# EAGLE design 2313proto (EAGLE 5.01)
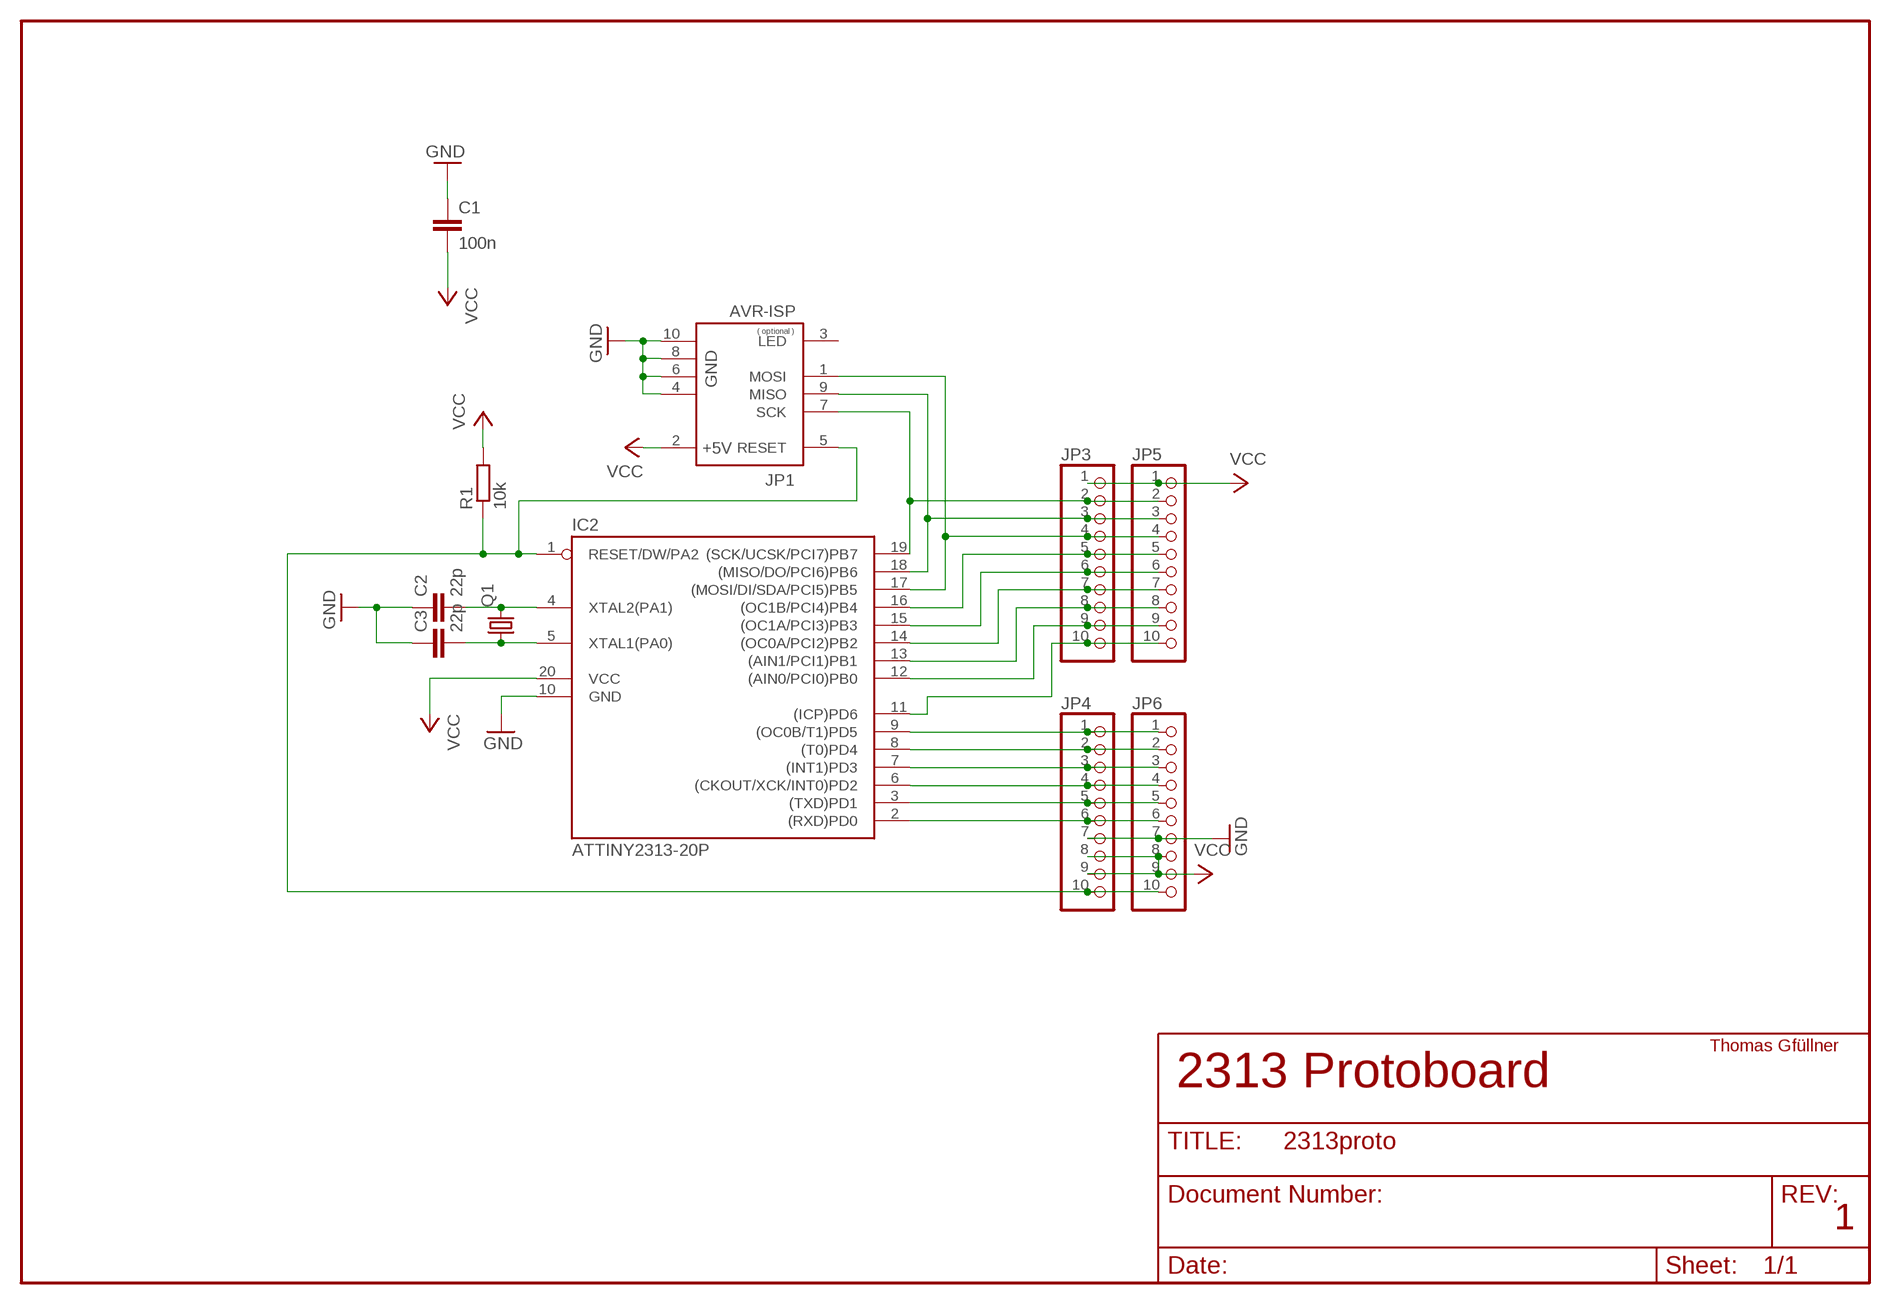
[diagram p0: schematic, sheet 1]

## Parts
C1  100n  C-EUC0805  [C0805]
C2  22p  C-EU025-024X044  [C025-024X044]
C3  22p  C-EU025-024X044  [C025-024X044]
IC2  ATTINY2313-20P  [DIL20]
JP1  AVR-ISP  [ML10]
JP3  PINHD-1X10  [1X10]
JP4  PINHD-1X10  [1X10]
JP5  PINHD-1X10  [1X10]
JP6  PINHD-1X10  [1X10]
Q1  CRYSTALHC49S  [HC49/S]
R1  10k  R-EU_R0805  [R0805]

## Nets
GND: C1.1 C2.1 C3.1 IC2.10(GND) JP1.4(GND) JP1.6(GND) JP1.8(GND) JP1.10(GND) JP4.7 JP6.7
N$1: C2.2 IC2.4(XTAL2(PA1)) Q1.2
N$2: C3.2 IC2.5(XTAL1(PA0)) Q1.1
N$3: IC2.3((TXD)PD1) JP4.5 JP6.5
N$4: IC2.2((RXD)PD0) JP4.6 JP6.6
N$5: IC2.16((OC1B/PCI4)PB4) JP3.5 JP5.5
N$6: IC2.15((OC1A/PCI3)PB3) JP3.6 JP5.6
N$7: IC2.13((AIN1/PCI1)PB1) JP3.8 JP5.8
N$8: IC2.12((AIN0/PCI0)PB0) JP3.9 JP5.9
N$12: IC2.9((OC0B/T1)PD5) JP4.1 JP6.1
N$13: IC2.8((T0)PD4) JP4.2 JP6.2
N$14: IC2.7((INT1)PD3) JP4.3 JP6.3
N$15: IC2.6((CKOUT/XCK/INT0)PD2) JP4.4 JP6.4
N$18: IC2.11((ICP)PD6) JP3.10 JP5.10
N$19: IC2.14((OC0A/PCI2)PB2) JP3.7 JP5.7
N$30: IC2.1(RESET/DW/PA2) JP1.5(RESET) JP4.10 JP6.10 R1.1
R1: IC2.19((SCK/UCSK/PCI7)PB7) JP1.7(SCK) JP3.2 JP5.2
R2: IC2.18((MISO/DO/PCI6)PB6) JP1.9(MISO) JP3.3 JP5.3
R3: IC2.17((MOSI/DI/SDA/PCI5)PB5) JP1.1(MOSI) JP3.4 JP5.4
VCC: C1.2 IC2.20(VCC) JP1.2(+5V) JP3.1 JP4.8 JP4.9 JP5.1 JP6.8 JP6.9 R1.2
Unconnected: JP1.3(LED)

## Notes on the sheet
- Thomas Gfüllner
- 2313 Protoboard
- 1

## Library data of the parts
C1 = resistor:C-EU: CAPACITOR, European symbol
C2 C3 = rcl:C-EU: CAPACITOR, European symbol
IC2 = avr:ATTINY2313: MICROCONTROLLER 2 Kbytes FLASH 128 bytes SRAM 128 bytes EEPROM USART USI
JP1 = roboternetz-definitionen:AVR-ISP: ISP ( In System Programming ) Stecker für AVRs Über diesen Anschluß kann ein AVR mit einem Standard ISP-Kabel direkt an einen Parallelport des PC´s angeschlossen und programmiert werden. Die Belegung des ISP-Anschlusses ist zu dem weit verbreitetet STK200 Programmier Dongle kompatibel. Ein entsprechender Dongle ist über zahlreiche Händler lieferbar. Es gibt aber auch viele Selbstbauanleitungen im Internet.
JP3-JP6 = pinhead:PINHD-1X10: PIN HEADER
Q1 = crystal:CRYSTAL: CRYSTAL
R1 = rcl:R-EU_: RESISTOR, European symbol

## Board
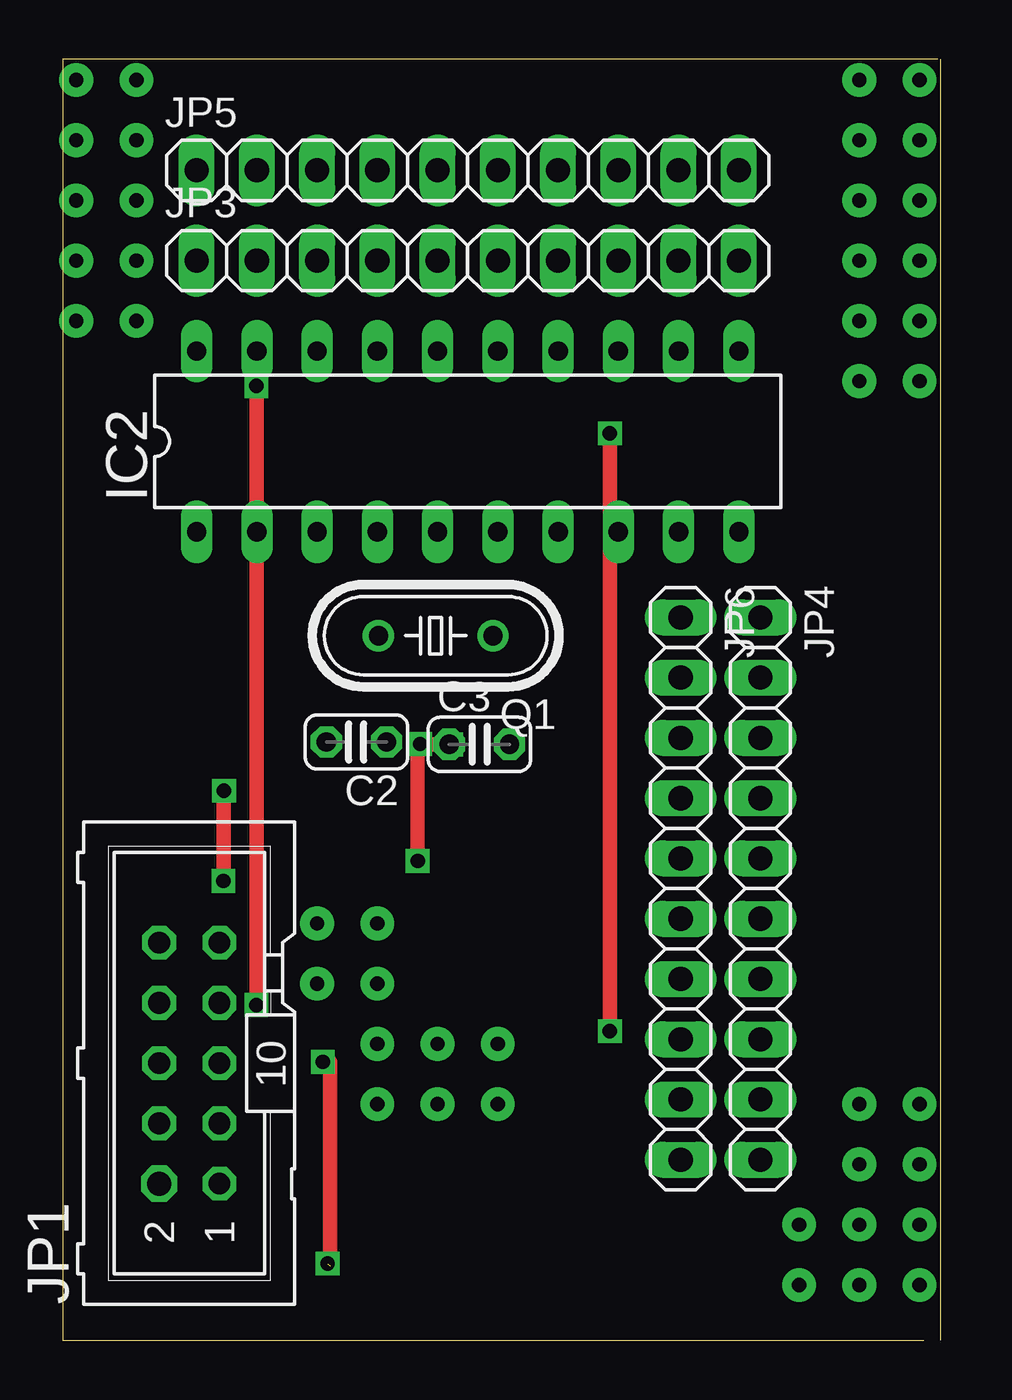
[diagram p1: board, top side]
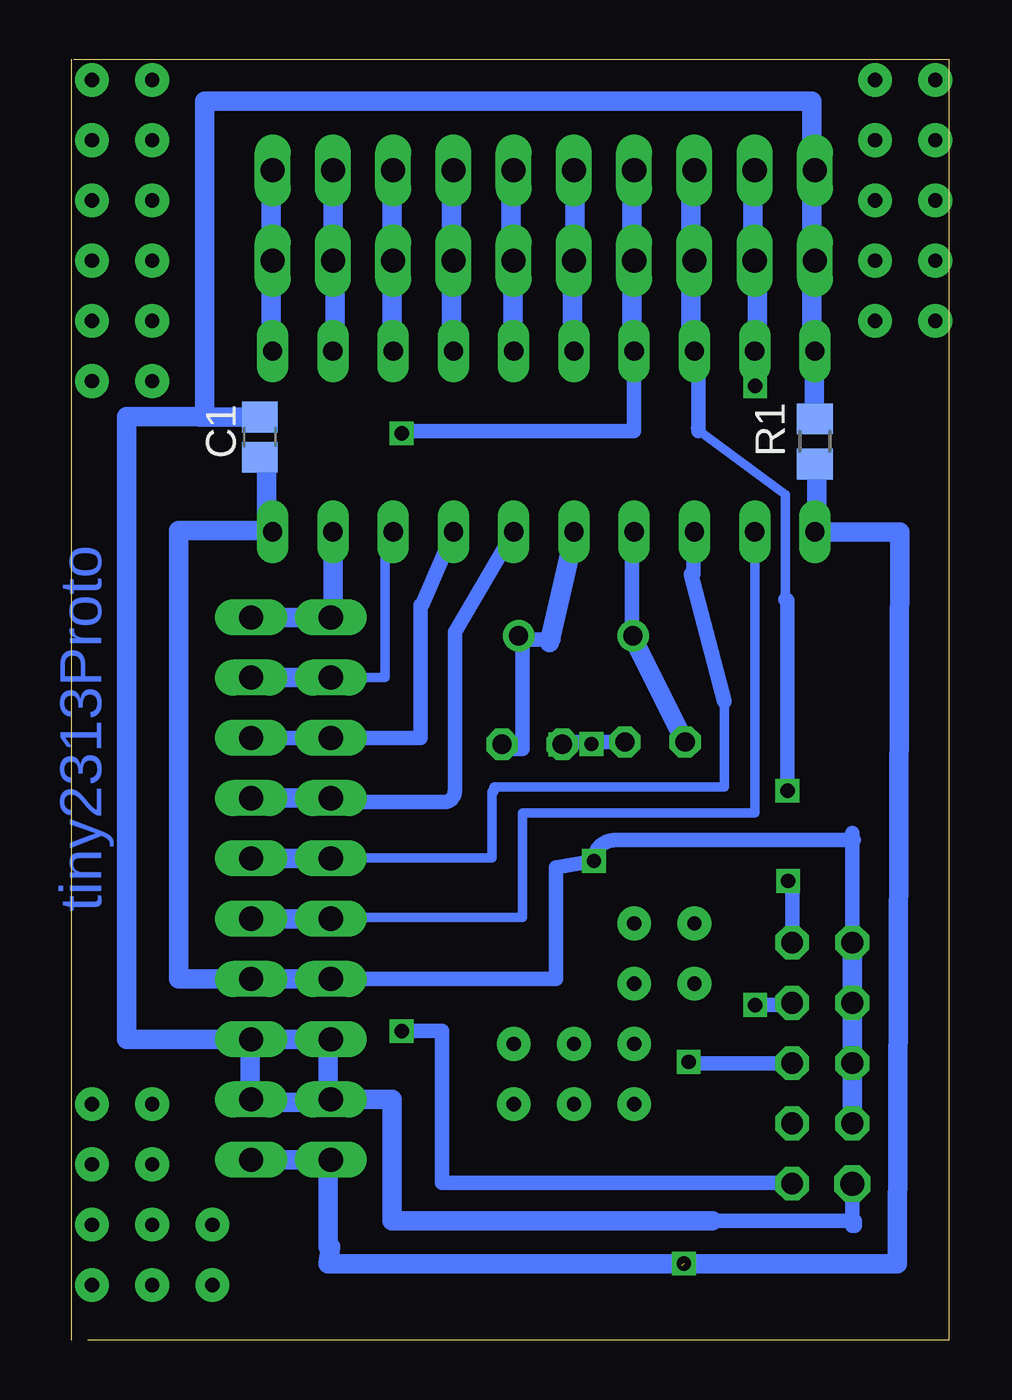
[diagram p2: board, bottom side, seen from below]

Size 37 x 54 mm. Coordinates in mm from the lower left corner, seen from the top.
Outline: 36.3,0 0,0 0,54 36.9,54
Outline: 37,54 37,0
Copper layers (1*16): Top 0.035mm / dielectric 1.5mm / Bottom 0.035mm
Design rules "default": minimum track width 10mil, minimum drill 24mil, track to track 8mil, track to pad 8mil, pad to pad 8mil, via to via 8mil, smd to smd 8mil, copper to edge 40mil, drill to drill 8mil, minimum pad ring 10mil, minimum via ring 8mil, stop-mask expansion 4mil, vias tented up to drill 0mil, thermal gap 10mil

### Footprints (pad centres in the part's own frame; a part is rotated, then mirrored left to right if it is on the bottom)
C0805 = smd 1.3 x 1.5: 1 -0.85,0; 2 0.85,0
C025-024X044 = drill 0.813 octagon: 1 -1.27,0; 2 1.27,0
DIL20 = drill 0.813 long: 1 -11.43,-3.81; 2 -8.89,-3.81; 3 -6.35,-3.81; 4 -3.81,-3.81; 5 -1.27,-3.81; 6 1.27,-3.81; 7 3.81,-3.81; 8 6.35,-3.81; 9 8.89,-3.81; 10 11.43,-3.81; 11 11.43,3.81; 12 8.89,3.81; 13 6.35,3.81; 14 3.81,3.81; 15 1.27,3.81; 16 -1.27,3.81; 17 -3.81,3.81; 18 -6.35,3.81; 19 -8.89,3.81; 20 -11.43,3.81
ML10 = drill 0.914 pad 1.422 octagon: 1 -5.08,-1.27; 3 -2.54,-1.27; 4 -2.54,1.27 | drill 1.016 pad 1.422 octagon: 2 -5.08,1.27 | drill 0.914 octagon: 5 0,-1.27; 6 0,1.27; 7 2.54,-1.27; 8 2.54,1.27; 9 5.08,-1.27; 10 5.08,1.27
1X10 = drill 1.016 long: 1 -11.43,0; 2 -8.89,0; 3 -6.35,0; 4 -3.81,0; 5 -1.27,0; 6 1.27,0; 7 3.81,0; 8 6.35,0; 9 8.89,0; 10 11.43,0
HC49/S = drill 0.813 round: 1 -2.413,0; 2 2.413,0
R0805 = smd 1.3 x 1.5: 1 -0.95,0; 2 0.95,0

### Placement (x,y rotation side)
C1  29.05,38.07 90 bottom
C2  12.39,25.22 180 top
C3  17.57,25.12 0 top
IC2  17.08,37.89 0 top
JP1  5.34,11.68 90 top
JP3  17.08,45.51 0 top
JP4  29.42,19.04 270 top
JP5  17.08,49.32 0 top
JP6  26.06,19.04 270 top
Q1  15.73,29.7 180 top
R1  5.65,37.89 90 bottom

### Tracks (layer width: path | path; a pad name or v marks a point on that pad's centre or on a via)
GND  (via drill 0.6)
  Top 0.61: v16.37,25.12 14.97,25.12 v14.97,20.2
  Bottom 0.61: C3.1 v16.37,25.12 16.37,25.22 C2.1 | 4.07,16.73 4.07,21.08 | 4.07,21.08 4.07,21.38 | 26.17,15.23 16.57,15.23 16.57,19.93 v14.97,20.2 arc90 14.09,21.08 4.07,21.08 | 4.07,21.08 4,21.08
  Bottom 0.813: 29.47,15.23 32.47,15.23 32.47,34.13 28.47,34.13 | 28.47,34.13 28.47,34.08 IC2.10 | C1.1 28.77,37.22 28.77,34.13 28.47,34.13 | 29.47,15.23 JP4.7 | JP6.7 26.17,15.23 29.47,15.23 | JP1.8 4.07,14.13 | JP1.8 4.07,16.73 JP1.10 | JP1.8 JP1.6 JP1.4
N$1
  Bottom 0.61: Q1.2 13.37,29.7 13.37,34.08 IC2.4
  Bottom 0.813: Q1.2 13.4,29.76 C2.2
N$2
  Bottom 0.61: 15.77,34.08 IC2.5 | 18.07,29.7 18.07,29.83 | 18.07,29.7 Q1.1 17.97,29.7 17.97,24.93 18.87,24.93 18.87,25.12 C3.2 | 16.67,29.53 16.83,29.53 18.07,29.53 18.07,29.7
  Bottom 0.813: 16.83,29.53 16.83,29.4 15.77,34.08
N$3
  Bottom 0.406: IC2.3 10.77,34.08 | 10.77,32.3 10.77,32.03 | 9.37,26.93 9.47,26.93 9.47,23.33 19.17,23.33 19.17,23.13 19.27,23.13 19.27,20.33 26.07,20.33 JP6.5 | JP6.5 26.07,20.23 | JP6.5
  Bottom 0.61: 9.47,26.93 10.87,32.3 10.77,32.3 10.78,33.93 IC2.3
  Bottom 0.813: 29.47,20.31 JP4.5 | JP6.5 29.47,20.31 | 29.47,20.31 29.47,20.23
N$4
  Bottom 0.406: IC2.2 8.17,34.08 8.17,22.23 17.97,22.23 17.97,17.83 26.17,17.83 26.17,17.77 | 26.17,17.77 26.17,17.73 | 26.17,17.77 JP6.6
  Bottom 0.813: 29.47,17.77 JP4.6 | 26.17,17.77 29.47,17.77 | 29.47,17.77 29.47,17.53
N$5
  Bottom 0.813: 15.87,45.51 15.87,45.73 | 15.87,45.51 JP3.5 15.77,45.51 15.77,49.32 | IC2.16 15.87,41.7 15.87,45.51 | 15.77,49.32 15.77,49.33 | 15.77,49.32 JP5.5
N$6
  Bottom 0.813: 18.37,45.51 18.37,45.73 | 18.37,45.51 JP3.6 18.47,45.51 18.47,49.32 JP5.6 | IC2.15 18.37,41.7 18.37,45.51
N$7
  Bottom 0.813: 23.47,45.51 23.47,45.73 | IC2.13 23.47,41.7 23.47,45.51 | 23.47,49.32 23.47,49.33 | 23.47,49.32 JP5.8 | 23.47,45.51 JP3.8 | 23.47,45.51 23.47,49.32
N$8
  Bottom 0.813: IC2.12 25.87,41.7 25.87,45.51 JP3.9 JP5.9
N$9
  Bottom 0.813: 26.07,10.03 29.47,10.03 29.47,10.13
N$10  (via drill 0.6)
  other vias: 15.07,25.13
N$11  (via drill 0.6 pad 1.42)
  other vias: 33.59,50.59
N$12
  Bottom 0.813: IC2.9 25.97,30.47 JP6.1 29.47,30.47 | 29.47,30.47 JP4.1 | 29.47,30.47 29.47,30.43
N$13
  Bottom 0.406: IC2.8 23.77,34.08 23.77,27.93 25.97,27.93 | 25.97,27.93 JP6.2 | 25.97,27.93 25.97,28.03
  Bottom 0.813: 29.67,27.93 JP4.2 | JP6.2 29.67,27.93 | 29.67,27.93 29.67,27.83
N$14
  Bottom 0.61: IC2.7 22.21,30.98 22.27,30.98 22.27,25.39 26.23,25.39 | 26.23,25.39 JP6.3 29.61,25.39 | 26.23,25.39 26.23,25.45 | 29.61,25.39 JP4.3 | 29.61,25.39
N$15
  Bottom 0.61: JP6.4 arc-90 25.9,22.69 21.27,22.69 arc-90 20.83,23.13 20.83,29.85 18.32,34.12 IC2.6
  Bottom 0.813: 29.47,22.85 JP4.4 | JP6.4 29.47,22.85 | 29.47,22.85 29.47,22.83
N$16  (via drill 0.6 pad 1.42)
  other vias: 36.13,50.59
N$17  (via drill 0.6 pad 1.42)
  other vias: 33.59,48.05
N$18
  Bottom 0.813: IC2.11 28.57,41.7 28.57,45.51 | 28.57,49.32 28.57,49.33 | 28.57,49.32 JP5.10 | 28.57,45.51 JP3.10 | 28.57,45.51 28.57,49.32
N$19
  Bottom 0.813: 20.97,45.51 20.97,45.73 | IC2.14 20.97,41.7 20.97,45.51 | JP5.7 20.97,49.32 20.97,45.51 | 20.97,45.51 JP3.7
N$20  (via drill 0.6 pad 1.42)
  other vias: 36.13,48.05
N$21  (via drill 0.6 pad 1.42)
  other vias: 36.13,45.51
N$22  (via drill 0.6 pad 1.42)
  other vias: 33.59,45.51
N$23  (via drill 0.6 pad 1.42)
  other vias: 33.59,42.97
N$24  (via drill 0.6 pad 1.42)
  other vias: 36.13,42.97
N$25  (via drill 0.6 pad 1.42)
  other vias: 36.13,40.43
N$26  (via drill 0.6 pad 1.42)
  other vias: 33.59,40.43
N$27  (via drill 0.6 pad 1.42)
  other vias: 33.59,9.95
N$28  (via drill 0.6 pad 1.42)
  other vias: 36.13,9.95
N$29  (via drill 0.6 pad 1.42)
  other vias: 36.13,7.41
N$30  (via drill 0.6)  (1 unrouted)
  Top 0.61: v10.97,11.73 11.27,11.73 11.27,3.13
  Bottom 0.61: JP1.5 10.97,11.68 v10.97,11.73
  Bottom 0.813: R1.1 5.57,36.94 5.57,34.08 IC2.1 2.07,34.08 2.17,3.23 v11.17,3.23 26.17,3.23 26.07,3.93 26.17,3.93 26.17,7.61 | 26.17,7.61 26.17,7.63 | 26.17,7.61 JP6.10 26.27,7.61 | 26.27,7.61 JP4.10 | 26.27,7.61 26.27,7.53
N$31  (via drill 0.6 pad 1.42)
  other vias: 33.59,7.41
N$32  (via drill 0.6 pad 1.42)
  other vias: 33.59,4.87
N$33  (via drill 0.6 pad 1.42)
  other vias: 36.13,4.87
N$34  (via drill 0.6 pad 1.42)
  other vias: 31.05,4.87
N$35  (via drill 0.6 pad 1.42)
  other vias: 31.05,2.33
N$36  (via drill 0.6 pad 1.42)
  other vias: 33.59,2.33
N$37  (via drill 0.6 pad 1.42)
  other vias: 36.13,2.33
N$38  (via drill 0.6 pad 1.42)
  other vias: 18.35,9.95
N$39  (via drill 0.6 pad 1.42)
  other vias: 18.35,12.49
N$40  (via drill 0.6 pad 1.42)
  other vias: 15.81,12.49
N$41  (via drill 0.6 pad 1.42)
  other vias: 15.81,9.95
N$42  (via drill 0.6 pad 1.42)
  other vias: 13.27,9.95
N$43  (via drill 0.6 pad 1.42)
  other vias: 13.27,12.49
N$44  (via drill 0.6 pad 1.42)
  other vias: 13.27,15.03
N$45  (via drill 0.6 pad 1.42)
  other vias: 13.27,17.57
N$46  (via drill 0.6 pad 1.42)
  other vias: 10.73,17.57
N$47  (via drill 0.6 pad 1.42)
  other vias: 10.73,15.03
N$48  (via drill 0.6 pad 1.42)
  other vias: 3.11,42.97
N$49  (via drill 0.6 pad 1.42)
  other vias: 3.11,45.51
N$50  (via drill 0.6 pad 1.42)
  other vias: 3.11,48.05
N$51  (via drill 0.6 pad 1.42)
  other vias: 3.11,50.59
N$52  (via drill 0.6 pad 1.42)
  other vias: 3.11,53.13
N$53  (via drill 0.6 pad 1.42)
  other vias: 0.57,53.13
N$54  (via drill 0.6 pad 1.42)
  other vias: 0.57,50.59
N$55  (via drill 0.6 pad 1.42)
  other vias: 0.57,48.05
N$56  (via drill 0.6 pad 1.42)
  other vias: 0.57,45.51
N$57  (via drill 0.6 pad 1.42)
  other vias: 0.57,42.97
N$58  (via drill 0.6 pad 1.42)
  other vias: 33.59,53.13
N$59  (via drill 0.6 pad 1.42)
  other vias: 36.13,53.13
R1  (via drill 0.6)
  Top 0.61: v8.17,40.23 v8.17,14.13
  Bottom 0.61: 8.07,41.7 8.17,41.7 v8.17,40.23 | JP1.7 6.67,14.22 6.67,14.13 v8.17,14.13
  Bottom 0.813: 8.07,45.51 8.07,45.53 | 8.07,45.51 JP3.2 8.27,45.51 8.27,49.32 JP5.2 | IC2.19 8.07,41.7 8.07,45.51
R2  (via drill 0.6)
  Top 0.61: v6.8,23.16 arc90 6.78,23.14 v6.78,19.36
  Bottom 0.406: 10.57,38.46 10.69,38.46 6.89,35.65 | 6.89,35.65 | 6.89,31.23 6.89,35.65
  Bottom 0.61: IC2.18 10.57,41.7 10.57,38.46 10.57,38.33 | 6.89,31.23 arc90 6.8,31.14 v6.8,23.16 | 6.59,16.72 6.59,16.74 | 6.59,16.74 arc-90 JP1.9 | v6.78,19.36 arc90 6.59,19.17 6.59,16.74
  Bottom 0.813: 10.87,45.51 10.87,45.63 | IC2.18 10.87,41.7 10.87,45.33 | JP5.3 10.77,49.32 10.77,49.23 10.87,49.23 10.87,45.33 | 10.87,45.33 10.87,45.51 | 10.87,45.51 JP3.3 | 6.67,16.63 6.67,16.76 JP1.9
R3  (via drill 0.6)
  Top 0.61: v23.07,38.23 v23.07,13.03
  Bottom 0.61: IC2.17 13.27,38.33 23.17,38.33 v23.07,38.23 | v23.07,13.03 21.37,13.03 21.37,6.63 6.67,6.63 6.67,6.6 | 6.67,6.53 6.67,6.6 | 6.67,6.6 JP1.1
  Bottom 0.813: 13.37,45.51 13.37,45.53 | IC2.17 13.37,41.7 13.37,45.51 | 13.37,45.51 JP3.4 | 13.37,49.32 13.37,49.33 | 13.37,49.32 JP5.4 | 13.37,45.51 13.37,49.32
VCC
  Bottom 0.61: 9.97,5.03 3.97,5.03 3.97,4.83 4.07,4.83 JP1.2
  Bottom 0.813: R1.2 5.67,38.84 5.67,41.7 IC2.20 5.77,41.7 5.77,45.51 | 5.77,45.51 5.77,45.53 | 5.77,49.32 5.77,49.43 | 5.77,45.51 JP3.1 | 5.77,49.32 5.77,45.51 | 31.47,38.92 31.57,38.92 | 31.47,38.92 31.37,38.92 | 31.37,38.92 C1.2 | JP4.8 34.67,12.69 34.67,38.93 31.47,38.93 31.47,38.92 | 9.97,5.03 23.47,5.03 23.47,10.15 JP6.9 26.17,10.15 | JP4.8 JP6.8 26.17,12.69 26.17,10.15 | JP4.8 29.57,12.69 29.57,12.73 | 26.17,10.15 26.17,10.03 | 29.47,12.69 29.47,12.73 | JP4.8 29.47,12.69 | JP4.9 29.47,10.15 29.47,12.69 | 5.77,49.32 JP5.1 | 5.77,49.32 5.77,52.23 31.37,52.23 31.37,38.92

### Text on the board
Bottom: tiny2313Proto